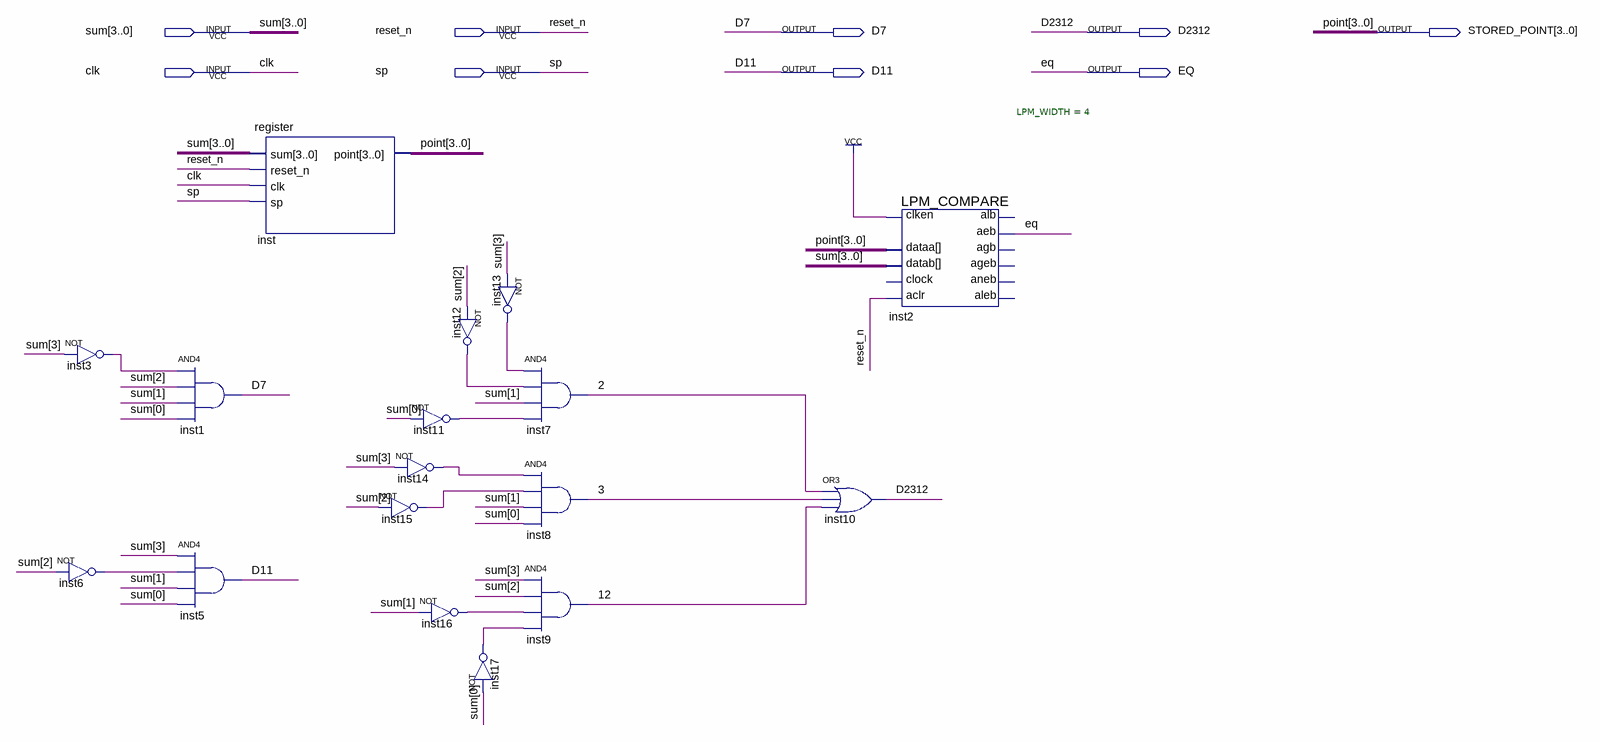
[diagram p0: schematic sheet]
// Quartus schematic dpathb.bdf as structural Verilog: 17 symbols, 9 pins
module dpathb (
  input  [3:0] sum,
  input  reset_n,
  input  clk,
  input  sp,
  output D7,
  output D2312,
  output [3:0] STORED_POINT,
  output D11,
  output EQ
);

  wire \2 , \3 , \12 , inst3_out, inst6_out, inst11_out, inst12_out, inst13_out, inst14_out, inst15_out,
       inst16_out, inst17_out;

  not inst3 (inst3_out, sum[3]);
  not inst6 (inst6_out, sum[2]);
  and inst1 (D7, inst3_out, sum[2], sum[1], sum[0]);
  and inst5 (D11, sum[3], inst6_out, sum[1], sum[0]);
  register inst (.sum(sum), .reset_n(reset_n), .clk(clk), .sp(sp), .point(STORED_POINT));
  not inst11 (inst11_out, sum[0]);
  not inst14 (inst14_out, sum[3]);
  not inst15 (inst15_out, sum[2]);
  not inst16 (inst16_out, sum[1]);
  not inst13 (inst13_out, sum[3]);
  not inst12 (inst12_out, sum[2]);
  not inst17 (inst17_out, sum[0]);
  and inst7 (\2 , inst13_out, inst12_out, sum[1], inst11_out);
  and inst8 (\3 , inst14_out, inst15_out, sum[1], sum[0]);
  and inst9 (\12 , sum[3], sum[2], inst16_out, inst17_out);
  or inst10 (D2312, \2 , \3 , \12 );
  LPM_COMPARE #(.LPM_WIDTH(4)) inst2 (
    .dataa(STORED_POINT), .datab(sum), .aclr(reset_n), .clken(1'b1), .aeb(EQ));  // open: clock, aleb, agb, aneb, ageb, alb

  // Other names for the same wires on the sheet: point[3:0] = STORED_POINT
endmodule
